# EAGLE design bt_mod (EAGLE 9.4.2)
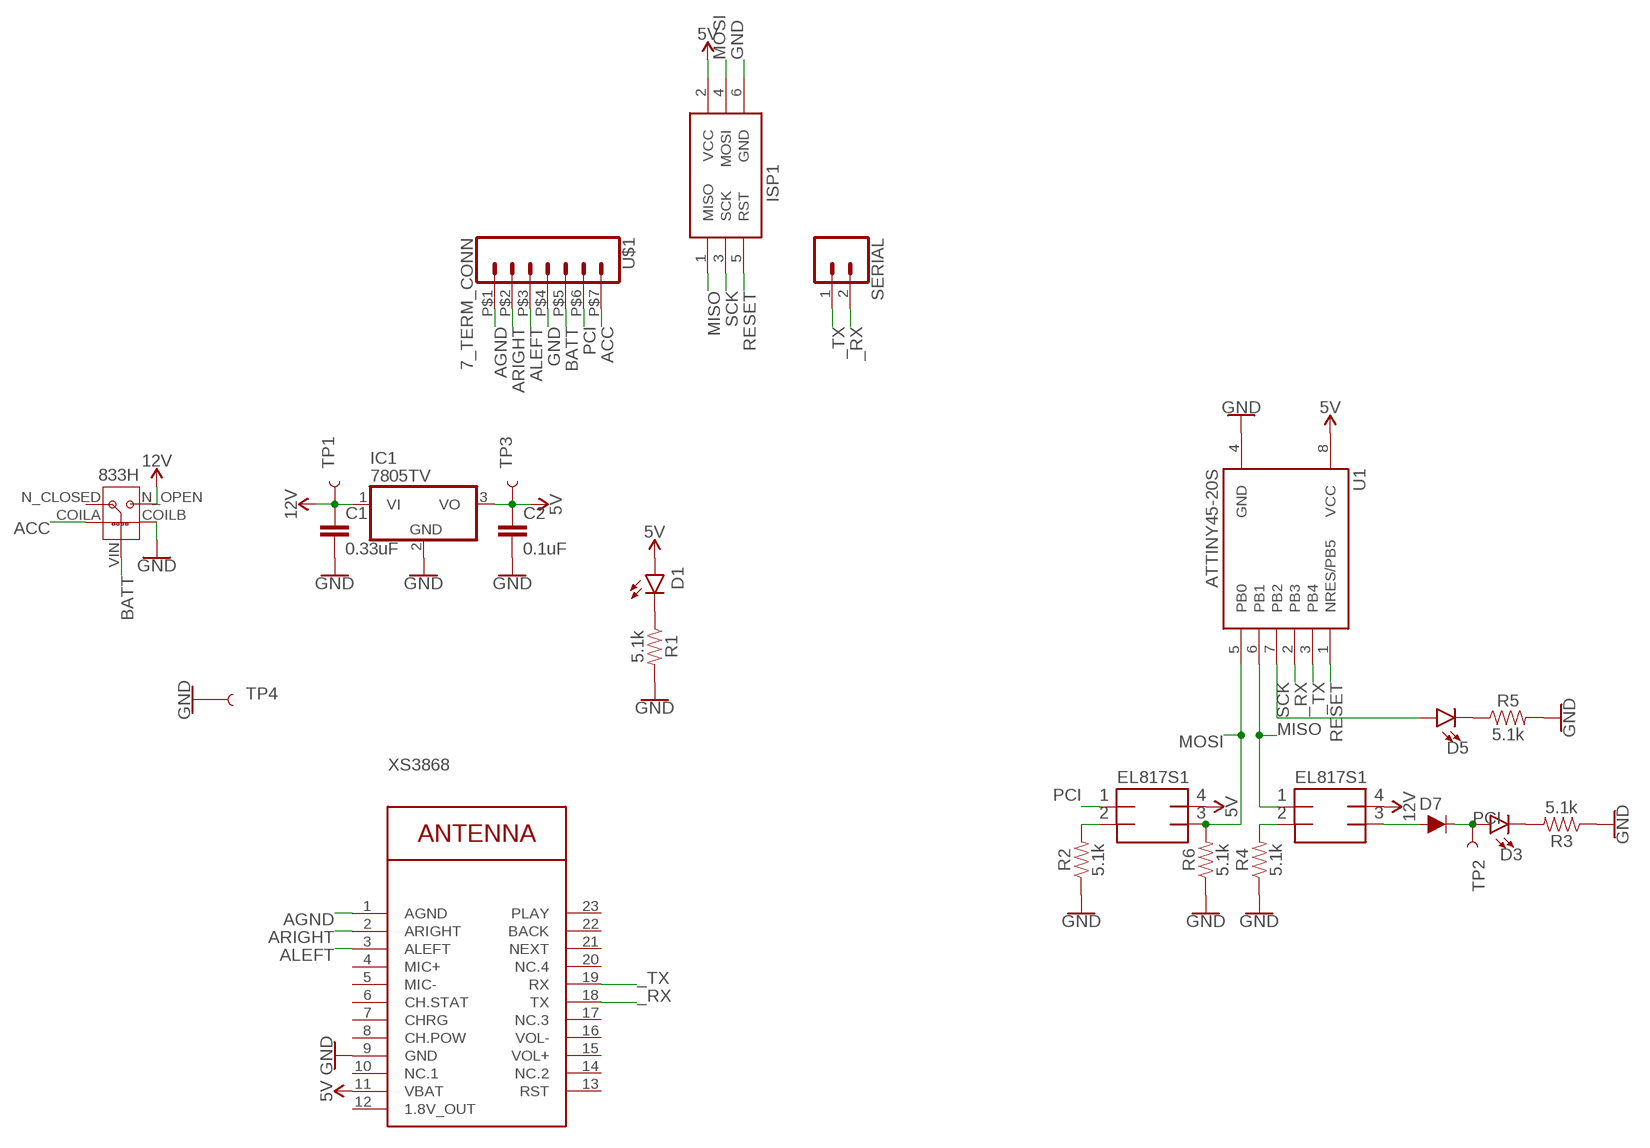
[diagram p0: schematic, sheet 1]

## Parts
1  833H-1C-C-12VDC  [833H-1C-C-12VDC]
C1  0.33uF  0.1UF-0603-25V-(+80/-20%)  [0603]
C2  0.1uF  0.1UF-0603-25V-(+80/-20%)  [0603]
D1  LED0603  [LED-0603]
D3  LED0603  [LED-0603]
D5  LED0603  [LED-0603]
D7  250mA/100V  DIODE-BAS16J  [SOD-323]
IC1  7805TV  [TO220V]
INPUT  EL3H7-G  [SMD-4]
ISP1  AVRISP-6  [AVRISP]
OUTPUT  EL3H7-G  [SMD-4]
R1  5.1k  5.1KOHM5.1KOHM-0603-1/10W-1%  [0603]
R2  5.1k  5.1KOHM5.1KOHM-0603-1/10W-1%  [0603]
R3  5.1k  5.1KOHM5.1KOHM-0603-1/10W-1%  [0603]
R4  5.1k  5.1KOHM5.1KOHM-0603-1/10W-1%  [0603]
R5  5.1k  5.1KOHM5.1KOHM-0603-1/10W-1%  [0603]
R6  5.1k  5.1KOHM5.1KOHM-0603-1/10W-1%  [0603]
SERIAL  CONN_02  [1X02]
TP1  TEST-POINT3X5  [PAD.03X.05]
TP2  TEST-POINT3X5  [PAD.03X.05]
TP3  TEST-POINT3X5  [PAD.03X.05]
TP4  TEST-POINT3X5  [PAD.03X.05]
U1  ATTINY45-20S  [SOIC8_EIAJ_208MIL]
U$1  7_TERM_CONN  [7_TERMINALS]
XS3868  WIRELESS-BLUETOOTH-XS3868  [WIRELESS-BLUETOOTH-XS3868]

## Nets
5V: C2.1 D1.A IC1.3(VO) INPUT.P$4 ISP1.2(VCC) TP3.P$1 U1.8(VCC) XS3868.11(VBAT)
12V: 1.N_OPEN C1.1 IC1.1(VI) OUTPUT.P$4 TP1.P$1
_RX: SERIAL.2 U1.2(PB3) XS3868.18(TX)
_TX: SERIAL.1 U1.3(PB4) XS3868.19(RX)
ACC: 1.COILA U$1.P$7
AGND: U$1.P$1 XS3868.1(AGND)
ALEFT: U$1.P$3 XS3868.3(ALEFT)
ARIGHT: U$1.P$2 XS3868.2(ARIGHT)
BATT: 1.VIN U$1.P$5
GND: 1.COILB C1.2 C2.2 IC1.2(GND) ISP1.6(GND) R1.2 R2.1 R3.1 R4.1 R5.2 R6.1 TP4.P$1 U1.4(GND) U$1.P$4 XS3868.9(GND)
MISO: ISP1.1(MISO) OUTPUT.P$1 U1.6(PB1)
MOSI: INPUT.P$3 ISP1.4(MOSI) R6.2 U1.5(PB0)
N$1: D1.C R1.1
N$2: INPUT.P$2 R2.2
N$4: OUTPUT.P$2 R4.2
N$5: D5.C R5.1
N$6: D3.C R3.2
N$15: D7.A OUTPUT.P$3
PCI: D3.A D7.C INPUT.P$1 TP2.P$1 U$1.P$6
RESET: ISP1.5(RST) U1.1(NRES/PB5)
SCK: D5.A ISP1.3(SCK) U1.7(PB2)
Unconnected: 1.N_CLOSED XS3868.4(MIC+) XS3868.5(MIC-) XS3868.6(CH.STAT) XS3868.7(CHRG) XS3868.8(CH.POW) XS3868.10(NC.1) XS3868.14(NC.2) XS3868.15(VOL+) XS3868.16(VOL-) XS3868.17(NC.3) XS3868.20(NC.4) XS3868.21(NEXT) XS3868.22(BACK) XS3868.23(PLAY)

## Power pins joined to a net without a drawn wire
1.8V_OUT: XS3868.12(1.8V_OUT)
RST: XS3868.13(RST)

## Library data of the parts
1 = 833H:833H-1C-C-12VDC: A 12VDC non-latching relay
C1 = SparkFun-Capacitors:0.1UF: 0.1µF ceramic capacitors A capacitor is a passive two-terminal electrical component used to store electrical energy temporarily in an electric field.; PROD_ID: CAP-00810; VALUE: 0.1uF
C2 = SparkFun-Capacitors:0.1UF: 0.1µF ceramic capacitors A capacitor is a passive two-terminal electrical component used to store electrical energy temporarily in an electric field.; PROD_ID: CAP-00810
D1 D3 D5 = SparkFun-LED:LED: LED (Generic) Standard schematic elements and footprints for 5mm, 3mm, 1206, and 0603 sized LEDs. Generic LEDs with no color specified.
D7 = SparkFun-DiscreteSemi:DIODE: Diode These are standard reverse protection diodes and small signal diodes. SparkFun Products: SparkFun SparkPunk Sound Kit <https://www.sparkfun.com/products/11177> SparkFun ESP8266 Thing <https://www.sparkfun.com/products/13231>; PROD_ID: DIO-09646
IC1 = linear:78*: Positive VOLTAGE REGULATOR Source: http://cache.national.com/ds/LM/LM78L05.pdf http://www.fairchildsemi.com/ds/LM/LM7805.pdf
INPUT OUTPUT = my-lib:EL3H7-G
ISP1 = adafruit:AVRISP: AVR ISP HEADER Standard 6 pin header for AVR programming
R1-R6 = SparkFun-Resistors:5.1KOHM; PROD_ID: RES-12083
SERIAL = SparkFun-Connectors:CONN_02: Multi connection point. Often used as Generic Header-pin footprint for 0.1 inch spaced/style header connections On any of the 0.1 inch spaced packages, you can populate with these: Break Away Headers - Straight <https://www.sparkfun.com/products/116> (PRT-00116) Break Away Male Headers - Right Angle <https://www.sparkfun.com/products/553> (PRT-00553) Female Headers <https://www.sparkfun.com/products/115> (PRT-00115) Break Away Headers - Machine Pin <https://www.sparkfun.com/products/117> (PRT-00117) Break Away Female Headers - Swiss Machine Pin <https://www.sparkfun.com/products/743> (PRT-00743) For SCREWTERMINALS and SPRING TERMINALS visit here: Screw Terimnals on SparkFun.com <https://www.sparkfun.com/search/results?term=Screw+Terminals> (5mm/3.5mm/2.54mm spacing) This device is also useful as a general connection point to wire up your design to another part of your project. Our various solder wires solder well into these plated through hole pads. Hook-Up Wire - Assortment (Stranded, 22 AWG) <https://www.sparkfun.com/products/11375> (PRT-11375) Hook-Up Wire - Assortment (Solid Core, 22 AWG) <https://www.sparkfun.com/products/11367> (PRT-11367) View the entire wire category on our website here <https://www.sparkfun.com/categories/141> Special notes: Molex polarized connector foot print use with: PRT-08233 with associated crimp pins and housings. 2.54_SCREWTERM for use with PRT-10571. 3.5mm Screw Terminal footprints for PRT-08084 5mm Screw Terminal footprints for use with PRT-08432
TP1-TP4 = SparkFun-Connectors:TEST-POINT: SparkFun Test Points Bare copper test points for troubleshooting or In-Circuit-Testing. These are used by our Production team for verifying production board runs using pogo-pins on test beds. SparkFun Products: SparkFun LSM9DS1 Breakout <https://www.sparkfun.com/products/13284> SparkFun PSOC <https://www.sparkfun.com/products/13714> SparkFun Load Cell Amplifier <https://www.sparkfun.com/products/13879>
U1 = _hhn_attiny25_45_85:ATTINY45*: ATMEL ATtiny 45 Packages: P = PDIP 08 30mil S = SOIC 08 EIAJ 208mil X = TSSOP 08 4.4mm Technologies Note: for complete ordering code (temp. range, finish, tape&reel etc.) see www.atmel.com • Supply Voltage: V = (1.8…5.5)V | [blank] = (2.7…5.5)V • Speed: 10 = 10 MHz | 20 = 20 MHz Author: Dipl.-Ing. FH Rainer Bayer HHN Hochschule Heilbronn (Heilbronn University), rainer.bayer@hs-heilbronn.de Ingenieurbüro ing-rb, mail@ing-rb.de
U$1 = my-lib:7_TERM_CONN
XS3868 = xs3868:WIRELESS-BLUETOOTH-XS3868: Bluetooth Stereo Audio Module based on OVC3860 chip More details available here: http://artofcircuits.com/product/bluetooth-2-0-edr-stereo-audio-ovc3860-module-model-xs-3868 Click here to find device on ebay.com <http://www.ebay.com/sch/xs3868+bluetooth+audio+module>

## Board
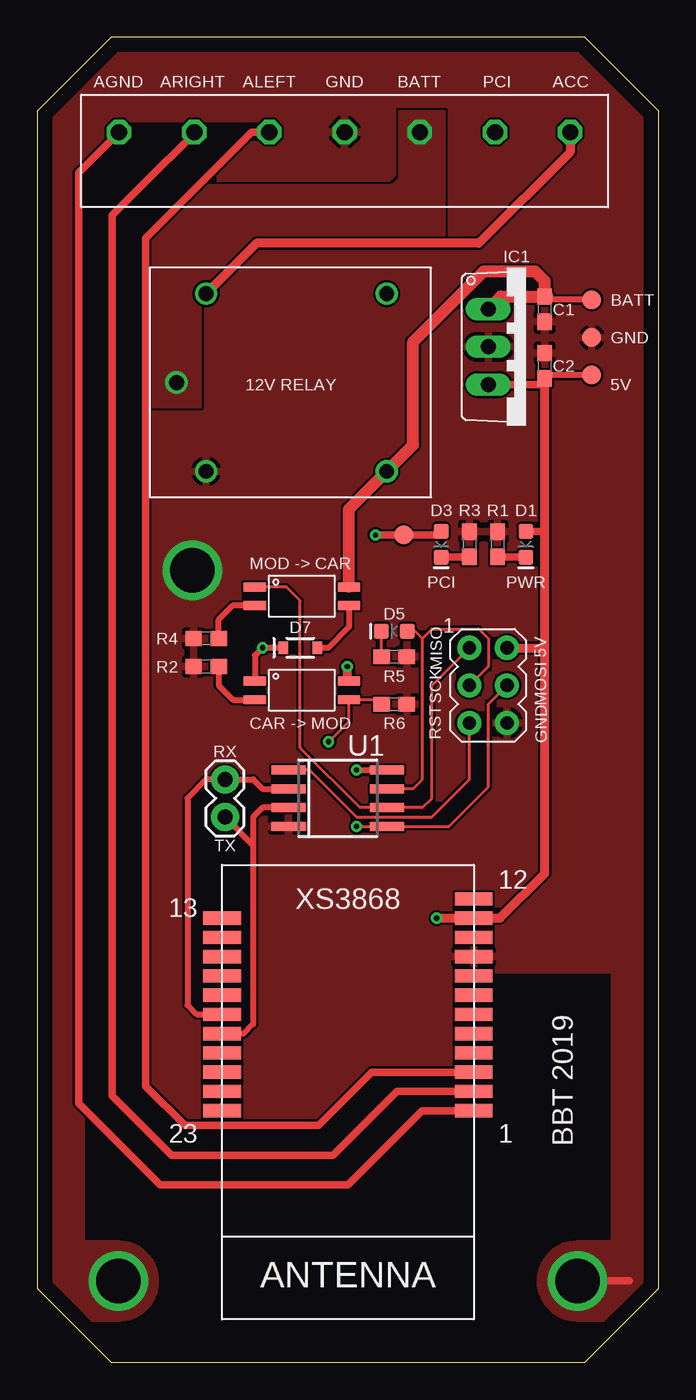
[diagram p1: board, top side]
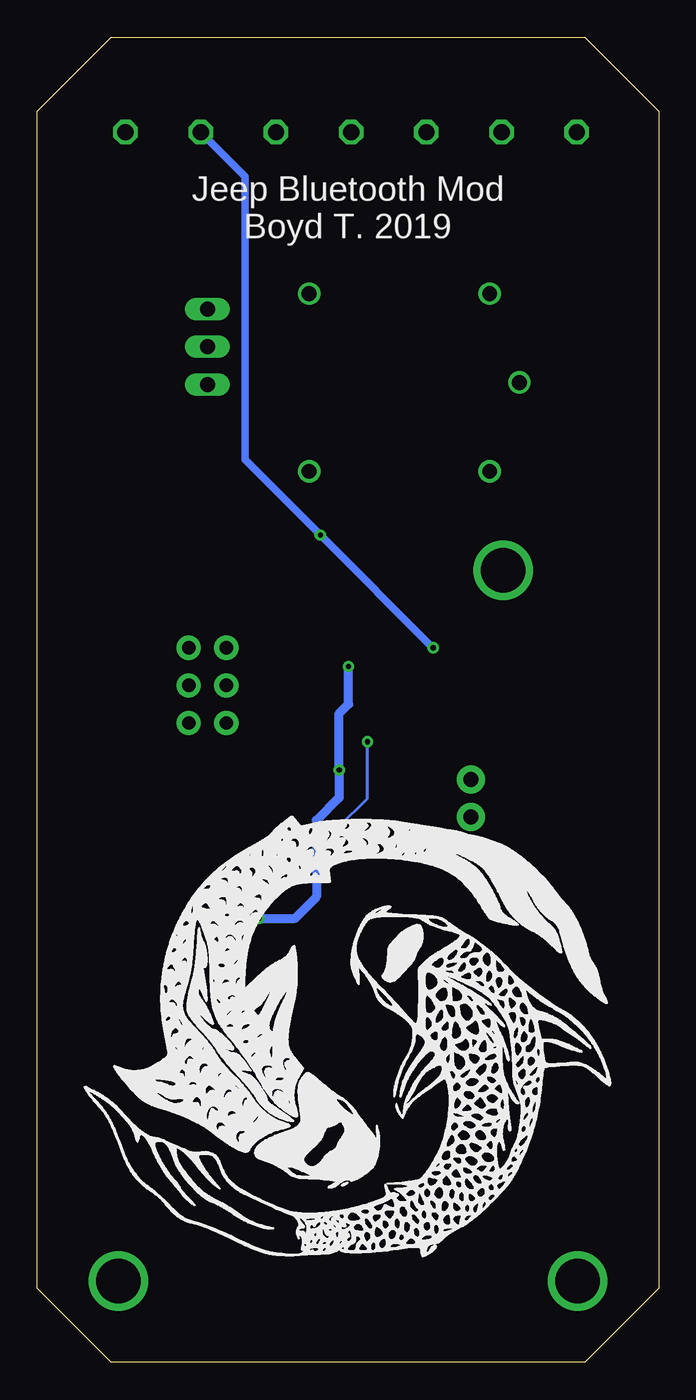
[diagram p2: board, bottom side, seen from below]

Size 42 x 89.5 mm. Coordinates in mm from the lower left corner, seen from the top.
Outline: 42,5 42,84.5 37,89.5 5,89.5 0,84.5 0,5 5,0 37,0 42,5
Copper layers (1*16): Top 0.035mm / dielectric 1.5mm / Bottom 0.035mm
Design rules "default": minimum track width 6mil, minimum drill 0.35mm, track to track 6mil, track to pad 6mil, pad to pad 6mil, via to via 6mil, smd to smd 6mil, copper to edge 40mil, drill to drill 6mil, minimum pad ring 10mil, minimum via ring 8mil, stop-mask expansion 4mil, vias tented up to drill 0mil, thermal gap 10mil

### Footprints (pad centres in the part's own frame; a part is rotated, then mirrored left to right if it is on the bottom)
833H-1C-C-12VDC = drill 1: COILA 3.8,13.75; COILB 3.8,1.75; N_CLOSED 16,13.75; N_OPEN 16,1.75; VIN 1.8,7.75
0603 = smd 1.1 x 1: 1 -0.85,0; 2 0.85,0
LED-0603 = smd 1 x 1: A -0.877,0; C 0.877,0
SOD-323 = smd 0.63 x 0.83: A 1.15,0; C -1.15,0
TO220V = drill 1.016 long: 1 -2.54,-2.54; 2 0,-2.54; 3 2.54,-2.54
SMD-4 = smd 1.5 x 0.6: P$1 0.75,1.57; P$2 0.75,0.3; P$3 7.1,0.3; P$4 7.1,1.57
AVRISP = drill 0.9 pad 1.626: 1 -1.27,2.54; 2 1.27,2.54; 3 -1.27,0; 4 1.27,0; 5 -1.27,-2.54; 6 1.27,-2.54
1X02 = drill 1.016 pad 1.88: 1 0,0; 2 2.54,0
PAD.03X.05 = smd 1.27 x 1.27: P$1 0,0
SOIC8_EIAJ_208MIL = smd 0.6 x 2.286: 1 -1.905,-3.33; 2 -0.635,-3.33; 3 0.635,-3.33; 4 1.905,-3.33; 5 1.905,3.33; 6 0.635,3.33; 7 -0.635,3.33; 8 -1.905,3.33
7_TERMINALS = drill 1.1 octagon: P$1 2.54,5.08; P$2 7.62,5.08; P$3 12.7,5.08; P$4 17.78,5.08; P$5 22.86,5.08; P$6 27.94,5.08; P$7 33.02,5.08
WIRELESS-BLUETOOTH-XS3868 = smd 2.54 x 0.889: 1 -8.5,0.995; 2 -8.5,-0.305; 3 -8.5,-1.605; 4 -8.5,-2.905; 5 -8.5,-4.205; 6 -8.5,-5.505; 7 -8.5,-6.805; 8 -8.5,-8.105; 9 -8.5,-9.405; 10 -8.5,-10.705; 11 -8.5,-12.005; 12 -8.5,-13.305; 13 8.5,-12.005; 14 8.5,-10.705; 15 8.5,-9.405; 16 8.5,-8.105; 17 8.5,-6.805; 18 8.5,-5.505; 19 8.5,-4.205; 20 8.5,-2.905; 21 8.5,-1.605; 22 8.5,-0.305; 23 8.5,0.995

### Placement (x,y rotation side)
1  7.62,58.42 0 top
C1  34.29,71.12 270 top
C2  34.29,67.31 90 top
D1  33.02,55.24 270 top
D3  27.3,55.24 270 top
D5  24.13,49.38 180 top
D7  17.78,48.26 0 top
IC1  33.02,68.58 270 top
INPUT  13.97,44.45 0 top
ISP1  30.48,45.72 0 top
OUTPUT  13.97,50.8 0 top
R1  31.11,55.24 90 top
R2  11.43,46.99 0 top
R3  29.21,55.24 270 top
R4  11.43,48.9 0 top
R5  24.13,47.66 0 top
R6  24.13,44.45 180 top
SERIAL  12.7,36.83 90 top
TP1  37.47,71.75 0 top
TP2  24.77,55.88 180 top
TP3  37.47,66.67 0 top
TP4  37.47,69.22 0 top
U1  20.32,38.1 270 top
U$1  3,78 0 top
XS3868  21,18 180 top

### Tracks (layer width: path | path; a pad name or v marks a point on that pad's centre or on a via)
5V  (via drill 0.35)
  Top 0.305: 20.95,46.13 INPUT.P$4
  Top 0.406: 34.29,66.04 C2.1 | TP3.P$1 34.29,66.67 | v21.59,40.01 U1.8
  Top 0.508: IC1.3 34.29,66.04 | D1.A 34.17,56.12
  Top 0.61: 34.29,56 34.29,66.04 34.29,66.67 | 34.17,56.12 34.29,56 | 34.29,48.26 34.29,33.02 31.27,30 XS3868.11 v27,30 | 34.29,48.26 34.29,56 | v20.95,46.99 20.95,46.13 | ISP1.2 34.29,48.26
  Bottom 0.61: v27,30 24.57,30 23.12,31.44 23.12,36.6 21.59,38.14 v21.59,40.01 21.59,43.81 20.95,44.45 v20.95,46.99
12V
  Top 0.406: TP1.P$1 34.29,71.75 C1.1 34.5,71.97
  Top 0.61: 30.16,73.66 30.14,73.64
  Top 0.813: OUTPUT.P$4 21.07,57.62 1.N_OPEN 25.4,61.95 25.4,68.9 30.14,73.64 | IC1.1 31.33,71.97 34.5,71.97 | C1.1 34.29,73.03 33.66,73.66 30.16,73.66
_RX
  Top 0.406: U1.2 15.24,38.73 14.61,39.37 SERIAL.2 11.43,39.37 10.16,38.1 10.16,24.14 10.79,23.5 XS3868.18
_TX
  Top 0.406: 14.61,34.92 SERIAL.1 | 14.61,34.92 14.61,36.83 15.24,37.47 U1.3 | 14.61,34.92 14.61,22.86 13.95,22.2 XS3868.19
ACC
  Top 0.61: 1.COILA 14.81,75.56 29.84,75.56 36.02,81.74 U$1.P$7
AGND
  Top 0.406: XS3868.1
  Top 0.508: XS3868.1 26,17 21,12 8.32,12 2.81,17.51 2.81,80.35 U$1.P$1
ALEFT
  Top 0.508: XS3868.3 22.61,19.61 19,16 10,16 7.35,18.65 7.35,75.93 14.5,83.08 U$1.P$3
ARIGHT
  Top 0.508: U$1.P$2 10.16,82.55 7.62,80.01 5.08,77.47 5.08,18 9.08,14 20,14 24.3,18.3 XS3868.2
BATT
  pour Top (no thermals): 7.5,64.5 7.5,76 11,79.5 24,79.5 24.5,80 24.5,84.5 27.5,84.5 27.5,75.5 15,75.5 11,71.5 11,64.5
GND  (via drill 3)
  Top 0.508: v36.5,5.5 40,5.5
  other vias: 10.5,53.5 5.5,5.5
  pour Top: 3,3 3,8 5.5,8 arc-90 8,5.5 arc-90 5.5,3
  pour Top: 39,3 36.5,3 arc-90 34,5.5 arc-90 36.5,8 39,8
  pour Top (rank 2): 42,89.5 42,26.5 28.5,26.5 28.5,20 28,19.5 22.5,19.5 19,16 10,16 7.5,18.5 7.5,76 14.5,83 16,84 6,84 3,81 3,27.5 0,27.5 0,89.5
  pour Top: 2.5,2.5 0,5 0,27.5 3,27.5 3,8 3.5,7.5 3.5,5 3,4.5 3,3
  pour Top: 39,3 39.5,2.5 42,5 42,27.5 39,27.5
MISO
  Top 0.203: OUTPUT.P$1 16.84,52.37 17.78,51.44 17.78,41.5 21.82,37.47 U1.6 26.04,37.47 26.67,38.1 26.67,45.72 ISP1.1
MOSI  (via drill 0.35)
  Top 0.203: v21.59,36.2 U1.5 27.81,36.2 30.48,38.87 30.48,44.45 ISP1.4 | R6.2 22.98,44.75 INPUT.P$3 21.07,43.3 v19.68,41.91
  Bottom 0.203: v21.59,36.2 19.68,38.1 v19.68,41.91
N$1
  Top 0.406: 32.99,54.4 D1.C
  Top 0.508: R1.1 32.99,54.4
N$2
  Top 0.406: R2.2 12.28,45.72 13.25,44.75 INPUT.P$2
N$4
  Top 0.406: OUTPUT.P$2 13.21,51.1 12.28,50.16 R4.2
N$5
  Top 0.203: R5.1 23.28,49.36 D5.C
N$6
  Top 0.406: D3.C 27.33,54.4
  Top 0.508: 27.33,54.4 R3.2
N$15
  Top 0.152: 19.05,48.26 D7.A
  Top 0.406: OUTPUT.P$3 21.07,49.65 19.68,48.26 19.05,48.26
PCI  (via drill 0.35)
  Top 0.406: D7.C v15.24,48.26 14.72,47.74 INPUT.P$1 | 27.3,55.88 D3.A
  Top 0.508: v22.86,55.88 TP2.P$1 27.3,55.88
  Bottom 0.508: v15.24,48.26 v22.86,55.88 27.94,60.96 27.94,80.08 U$1.P$6
RESET
  Top 0.203: U1.1 18.41,40.01 21.59,36.83 26.67,36.83 29.21,39.37 ISP1.5
SCK
  Top 0.203: U1.7 25.4,38.73 26.04,39.37 26.04,48.9 | ISP1.3 30.48,46.99 30.48,48.9 29.84,49.53 26.67,49.53 26.04,48.9 | D5.A 25.55,49.38 26.04,48.9

### Text on the board
tPlace: 12V RELAY
bPlace: Jeep Bluetooth Mod / Boyd T. 2019
tNames: AGND | ARIGHT | ALEFT | GND | BATT | PCI | ACC | BATT | GND | 5V | MOD -> CAR | PCI | PWR | MISO | 5V | SCK | MOSI | CAR -> MOD | RST | GND | RX | TX | BBT 2019